# EAGLE design actuators (EAGLE 8.1.0)
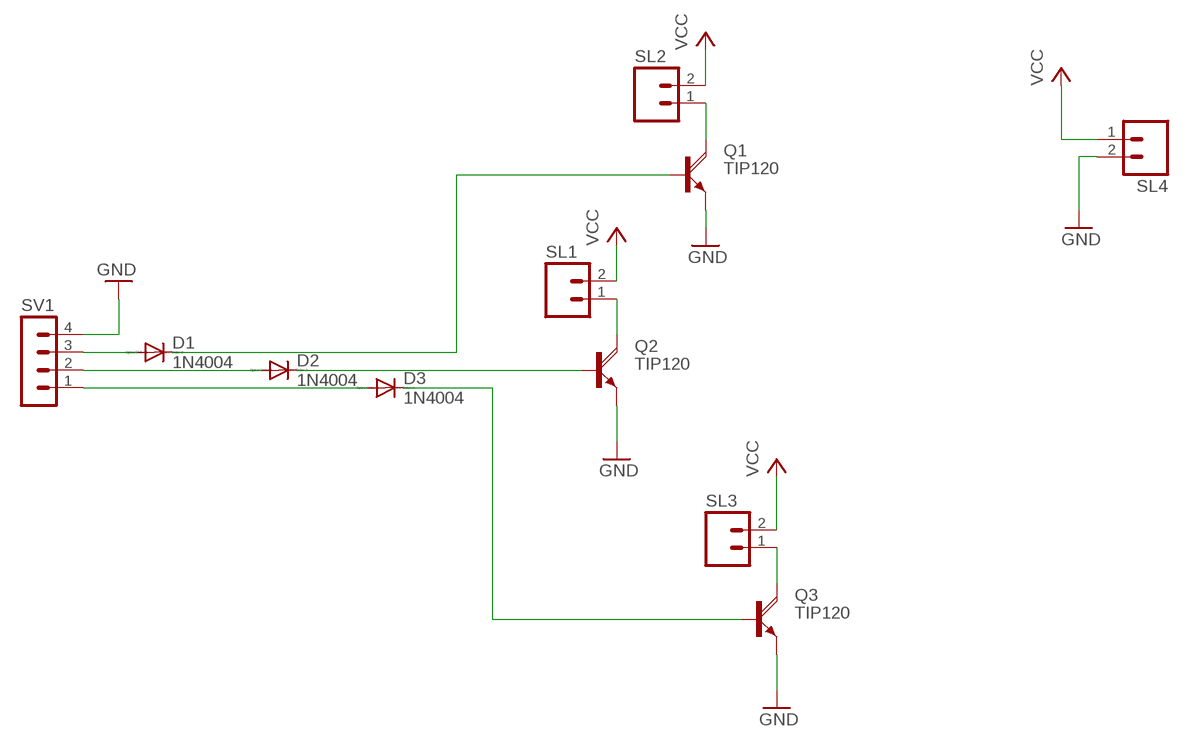
[diagram p0: schematic, sheet 1]

## Parts
D1  1N4004  [DO41-10]
D2  1N4004  [DO41-10]
D3  1N4004  [DO41-10]
Q1  TIP120  [TO220AH]
Q2  TIP120  [TO220AH]
Q3  TIP120  [TO220AH]
SL1  MA02  [02PA]
SL2  MA02  [02PA]
SL3  MA02  [02PA]
SL4  MA02  [02PA]
SV1  MA04-1  [MA04-1]

## Nets
GND: Q1.E Q2.E Q3.E SL4.2 SV1.4
N$1: D1.C Q1.B
N$2: D1.A SV1.3
N$3: D2.A SV1.2
N$4: Q1.C SL2.1
N$5: Q2.C SL1.1
N$6: Q3.C SL3.1
N$7: D2.C Q2.B
N$8: D3.A SV1.1
N$9: D3.C Q3.B
VCC: SL1.2 SL2.2 SL3.2 SL4.1

## Library data of the parts
D1-D3 = diode:1N4004: DIODE general purpose rectifier, 1 A
Q1-Q3 = transistor-power:TIP120: NPN DARLINGTON TRANSISTOR
SL1-SL4 = con-amp-quick:MA02: AMP QUICK CONNECTOR; OC_FARNELL: unknown; OC_NEWARK: unknown
SV1 = con-lstb:MA04-1: PIN HEADER; OC_FARNELL: unknown; OC_NEWARK: unknown

## Board
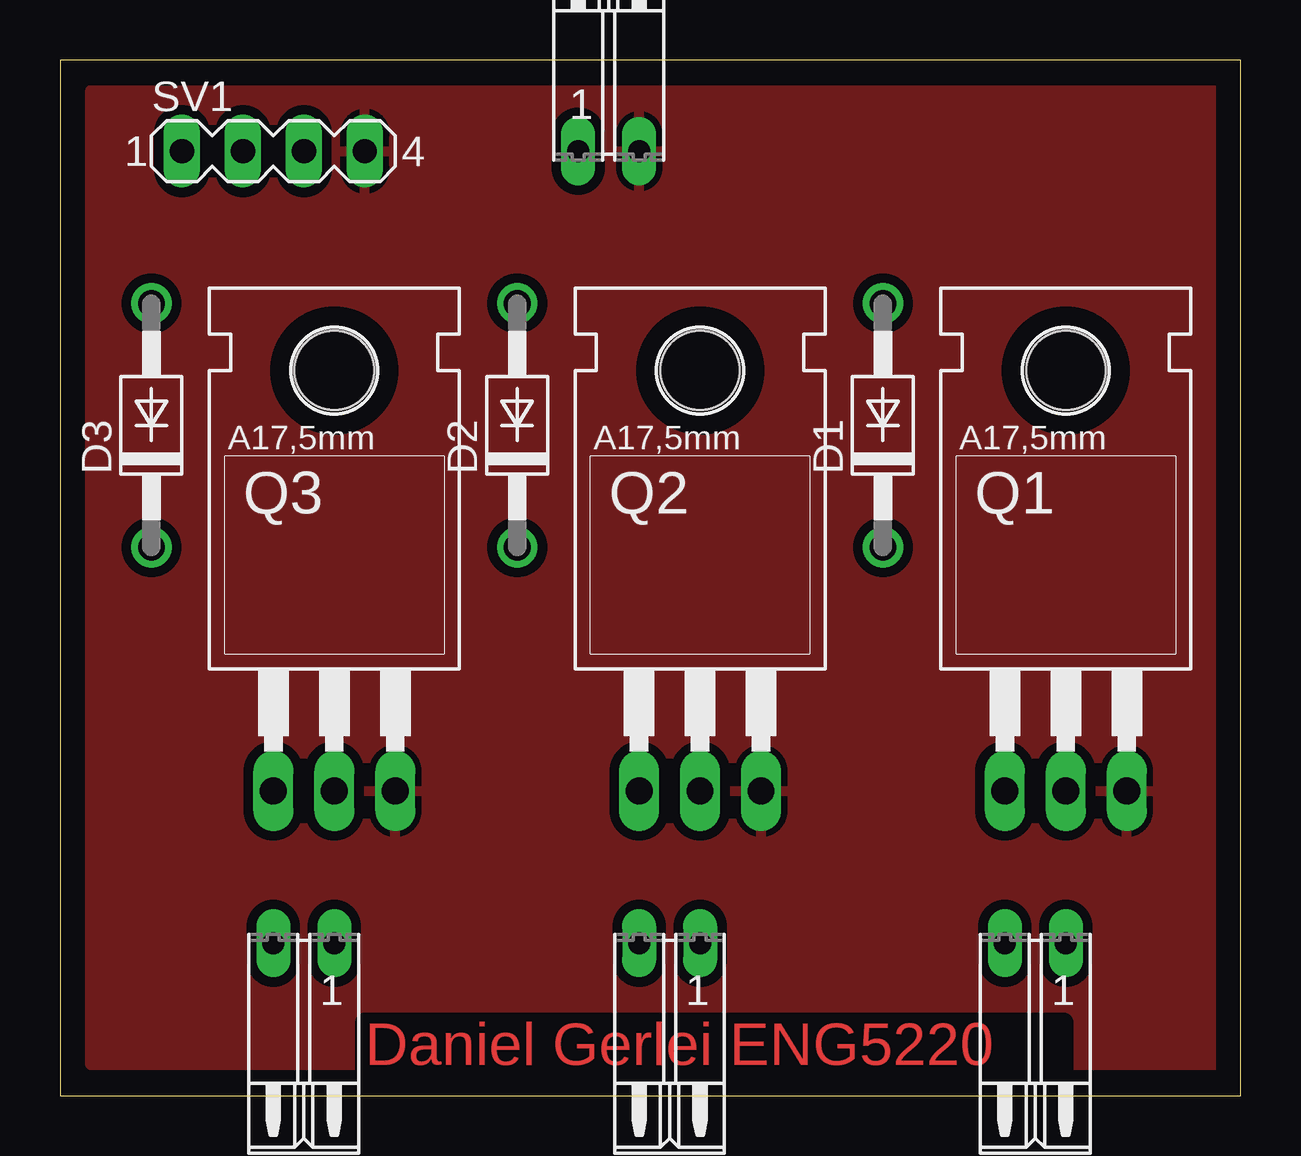
[diagram p1: board, top side]
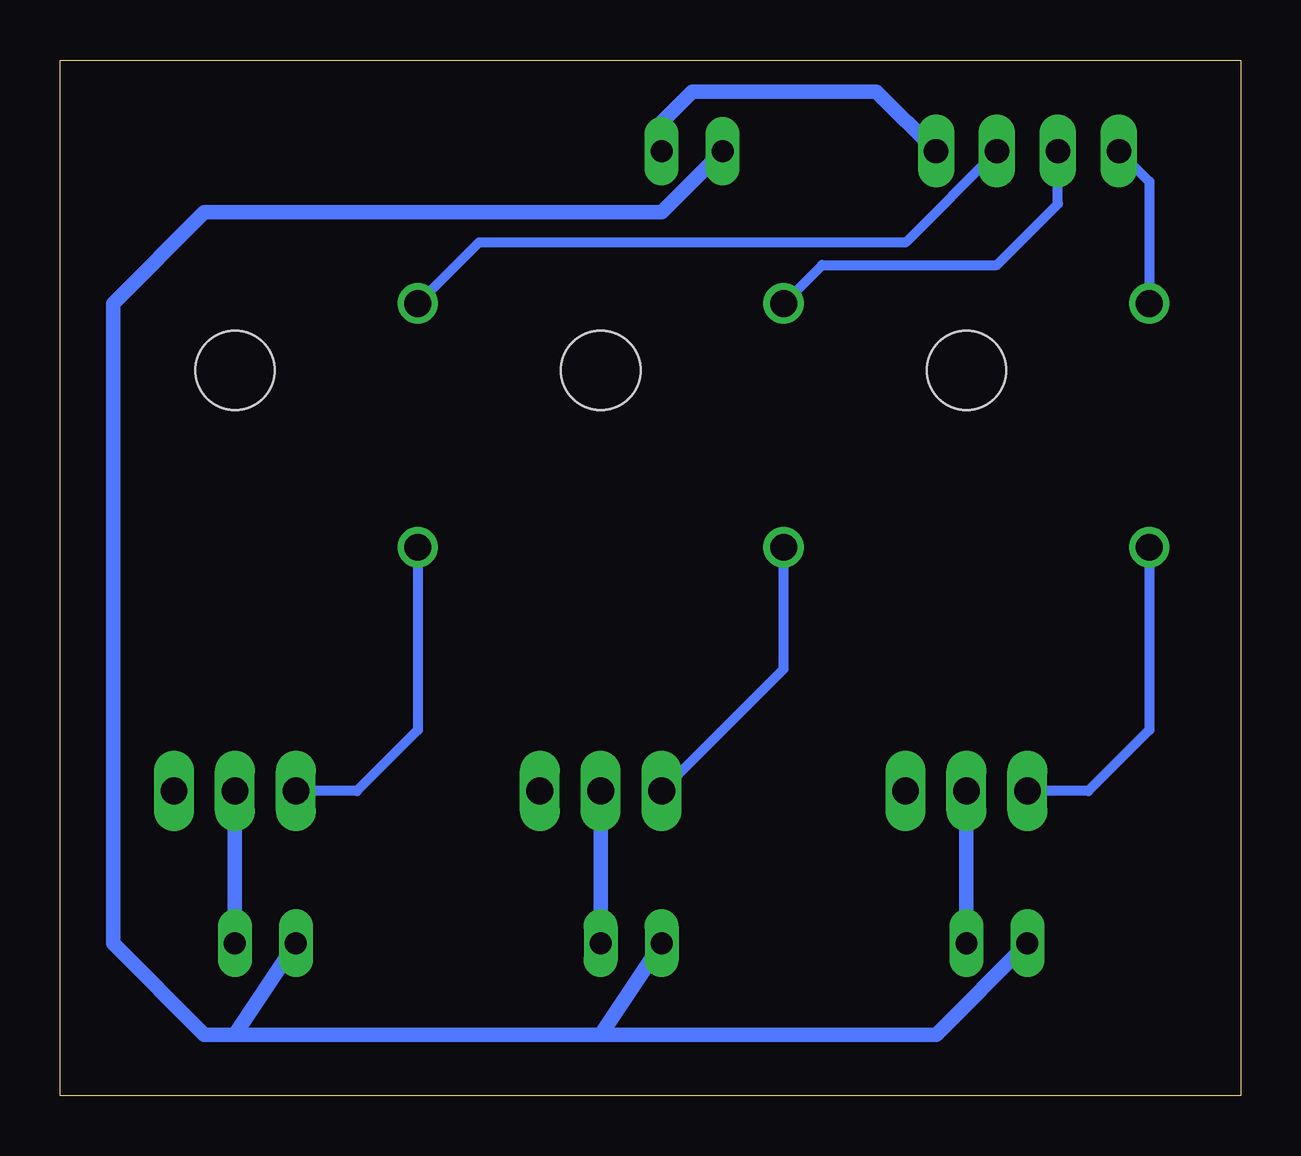
[diagram p2: board, bottom side, seen from below]

Size 49.2 x 43.17 mm. Coordinates in mm from the lower left corner, seen from the top.
Outline: 0,0 49.2,0 49.2,43.17 0,43.17 0,0
Copper layers (1*16): Top 0.035mm / dielectric 1.5mm / Bottom 0.035mm
Design rules "default": minimum track width 10mil, minimum drill 24mil, track to track 8mil, track to pad 8mil, pad to pad 8mil, via to via 8mil, smd to smd 8mil, copper to edge 40mil, drill to drill 8mil, minimum pad ring 10mil, minimum via ring 8mil, stop-mask expansion 4mil, vias tented up to drill 0mil, thermal gap 10mil

### Footprints (pad centres in the part's own frame; a part is rotated, then mirrored left to right if it is on the bottom)
DO41-10 = drill 1.118: A 5.08,0; C -5.08,0
TO220AH = drill 1.118 long: B -2.54,-6.35; C 0,-6.35; E 2.54,-6.35 | hole 3.302: 0,11.176
02PA = drill 0.914 long: 1 -1.27,0; 2 1.27,0
MA04-1 = drill 1.016 long: 1 -3.81,0; 2 -1.27,0; 3 1.27,0; 4 3.81,0

### Placement (x,y rotation side)
D1  34.29,27.94 90 top
D2  19.05,27.94 90 top
D3  3.81,27.94 90 top
Q1  41.91,19.05 0 top
Q2  26.67,19.05 0 top
Q3  11.43,19.05 0 top
SL1  25.4,6.35 180 top
SL2  40.64,6.35 180 top
SL3  10.16,6.35 180 top
SL4  22.86,39.37 0 top
SV1  8.89,39.37 0 top

### Tracks (layer width: path | path; a pad name or v marks a point on that pad's centre or on a via)
GND
  Bottom 0.61: SV1.4 15.18,41.85 22.86,41.85 24.13,40.58 SL4.2
  pour Top (isolate 0.406): 1.27,41.91 48.26,41.91 48.26,1.27 1.27,1.27
N$1
  Bottom 0.406: D1.C 34.29,15.24 36.83,12.7 Q1.B
N$2
  Bottom 0.406: SV1.3 13.97,35.56 31.75,35.56 D1.A
N$3
  Bottom 0.406: D2.A 17.45,34.62 10.16,34.62 7.62,37.16 SV1.2
N$4
  Bottom 0.61: SL2.1 Q1.C
N$5
  Bottom 0.61: SL1.1 Q2.C
N$6
  Bottom 0.61: SL3.1 Q3.C
N$7
  Bottom 0.406: Q2.B 19.05,17.78 D2.C
N$8
  Bottom 0.406: SV1.1 3.81,38.1 D3.A
N$9
  Bottom 0.406: D3.C 3.81,15.24 6.35,12.7 Q3.B
VCC
  Bottom 0.61: SL3.2 12.7,2.54 26.67,2.54 | 26.67,2.54 SL1.2 | 26.67,2.54 41.91,2.54 | 41.91,2.54 SL2.2 | SL4.1 24.13,36.83 43.18,36.83 46.99,33.02 46.99,6.35 43.18,2.54 41.91,2.54

### Text on the board
Top: Daniel Gerlei ENG5220